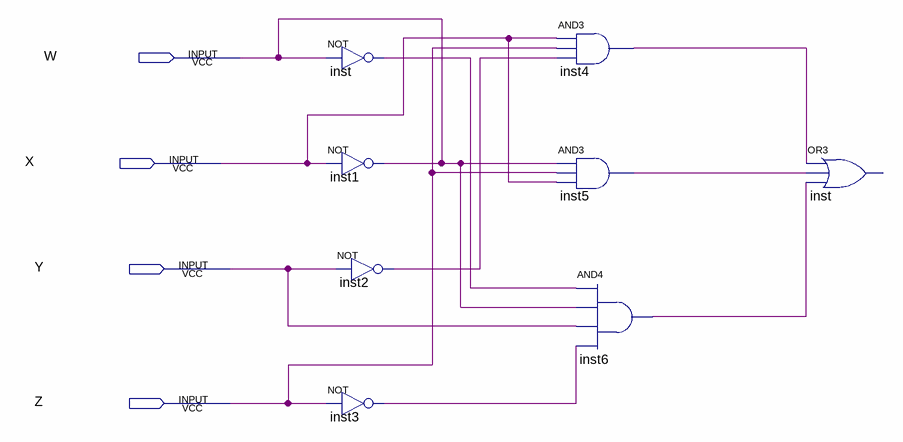
[diagram p0: schematic sheet]
// Quartus schematic B_Fix.bdf as structural Verilog: 8 symbols, 4 pins
module B_Fix (
  input  W,
  input  X,
  input  Y,
  input  Z
);

  wire inst2_out, inst3_out, inst4_out, inst5_out, inst6_out, inst_out;

  not inst (inst_out, W);
  not inst1 (W, X);
  not inst2 (inst2_out, Y);
  not inst3 (inst3_out, Z);
  and inst4 (inst4_out, X, Z, inst2_out);
  and inst5 (inst5_out, W, Z, X);
  and inst6 (inst6_out, inst_out, W, Y, inst3_out);
  // OR3 inst has open pins: IN1=inst4_out, IN2=inst5_out, IN3=inst6_out, OUT=open
endmodule
